# EAGLE schematic UniversalPSU_NoJump (EAGLE 6.6.0)
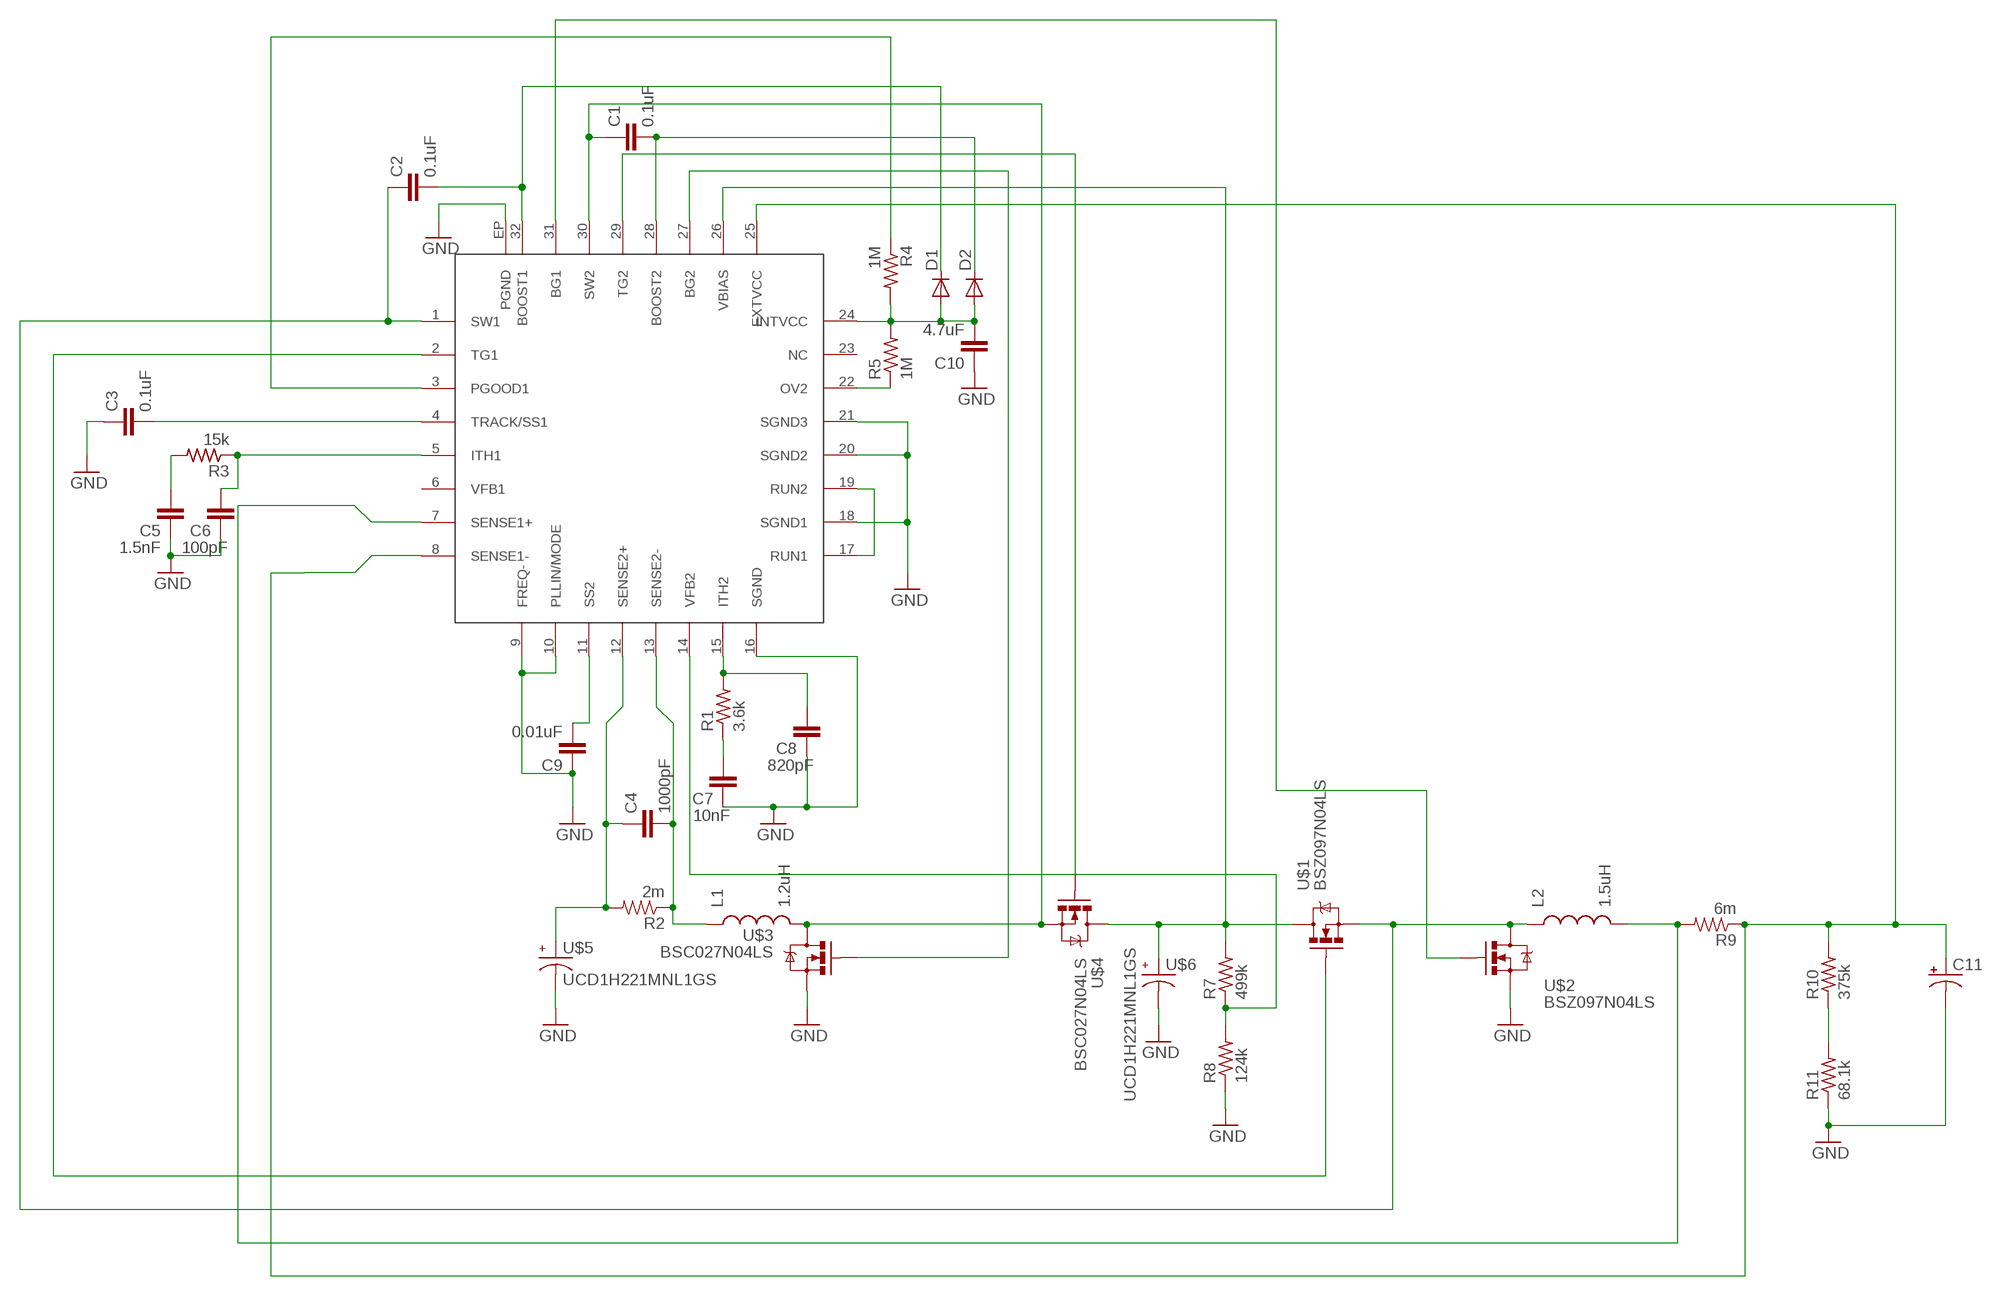
[diagram p0: schematic, sheet 1]

## Parts
C1  0.1uF  RF-C0805  [C0805]
C2  0.1uF  RF-C0805  [C0805]
C3  0.1uF  RF-C0805  [C0805]
C4  1000pF  RF-C0805  [C0805]
C5  1.5nF  RF-C0805  [C0805]
C6  100pF  RF-C0805  [C0805]
C7  10nF  RF-C0805  [C0805]
C8  820pF  RF-C0805  [C0805]
C9  0.01uF  RF-C0805  [C0805]
C10  4.7uF  RF-C0805  [C0805]
C11  CAP_POL7343  [EIA7343]
D1  DIODESOD  [SOD-323]
D2  DIODESOD  [SOD-323]
L1  1.2uH  INDUCTOR  [744325120]
L2  1.5uH  INDUCTOR-1  [744314150]
R1  3.6k  RF-R0805  [RF-C0805]
R2  2m  RESISTOR1206  [1206]
R3  15k  RF-R0805  [RF-C0805]
R4  1M  RF-R0805  [RF-C0805]
R5  1M  RF-R0805  [RF-C0805]
R7  499k  RF-R0805  [RF-C0805]
R8  124k  RF-R0805  [RF-C0805]
R9  6m  RESISTOR1206  [1206]
R10  375k  RF-R0805  [RF-C0805]
R11  68.1k  RF-R0805  [RF-C0805]
U1  LTC7812  [QFN-32_UH]
U$1  BSZ097N04LS  [PG-TSDSON-8]
U$2  BSZ097N04LS  [PG-TSDSON-8]
U$3  BSC027N04LS  [PG-TSDSON-8]
U$4  BSC027N04LS  [PG-TSDSON-8]
U$5  UCD1H221MNL1GS  [10X10CAP]
U$6  UCD1H221MNL1GS  [10X10CAP]

## Nets
GND: C3.1 C5.1 C6.1 C7.1 C8.1 C9.1 C10.1 C11.C(-) R8.1 R11.1 U1.9(FREQ-) U1.10(PLLIN/MODE) U1.16(SGND) U1.18(SGND1) U1.20(SGND2) U1.21(SGND3) U1.EP(PGND) U$2.P$1(S) U$2.P$2(S) U$2.P$3(S) U$3.P$1(S) U$3.P$2(S) U$3.P$3(S) U$5.P$1 U$6.P$1
N$1: C3.2 U1.4(TRACK/SS1)
N$2: C2.2 D1.1(C) U1.32(BOOST1)
N$3: C2.1 L2.P$1 U1.1(SW1) U$1.P$1(S) U$1.P$2(S) U$1.P$3(S) U$2.P$5(D)
N$4: C1.2 D2.1(C) U1.28(BOOST2)
N$5: C1.1 L1.P$2 U1.30(SW2) U$3.P$5(D) U$4.P$1(S) U$4.P$2(S) U$4.P$3(S)
N$6: C8.2 R1.2 U1.15(ITH2)
N$7: C4.2 L1.P$1 R2.1 U1.13(SENSE2-)
N$8: C4.1 R2.2 U1.12(SENSE2+) U$5.P$2
N$9: C6.2 R3.1 U1.5(ITH1)
N$10: C5.2 R3.2
N$11: C7.2 R1.1
N$12: R5.1 U1.22(OV2)
N$13: C9.2 U1.11(SS2)
N$14: R4.1 U1.3(PGOOD1)
N$15: L2.P$2 R9.2 U1.7(SENSE1+)
N$16: C11.A(+) R9.1 R10.2 U1.8(SENSE1-) U1.25(EXTVCC)
N$17: C10.2 D1.2(A) D2.2(A) R4.2 R5.2 U1.24(INTVCC)
N$18: U1.27(BG2) U$3.P$4(G)
N$19: U1.29(TG2) U$4.P$4(G)
N$20: U1.17(RUN1) U1.19(RUN2)
N$21: R7.2 U1.26(VBIAS) U$1.P$5(D) U$4.P$5(D) U$6.P$2
N$22: R7.1 R8.2 U1.14(VFB2)
N$23: U1.2(TG1) U$1.P$4(G)
N$25: U1.31(BG1) U$2.P$4(G)
N$28: R10.1 R11.2
Unconnected: U1.6(VFB1) U1.23(NC)

## Library data of the parts
C1-C10 = GW-devices:RF-C: RF capacitor pads for FSL reference design
C11 = SparkFun:CAP_POL: Capacitor Polarized These are standard SMD and PTH capacitors. Normally 10uF, 47uF, and 100uF in electrolytic and tantalum varieties. Always verify the external diameter of the through hole cap, it varies with capacity, voltage, and manufacturer. The EIA devices should be standard.
D1 D2 = SparkFun:DIODE: Diode These are standard reverse protection diodes and small signal diodes. SMA package can handle up to about 1A. SOD-323 can handle about 200mA. What the SOD-323 package when ordering, there are some mfgs out there that are 5-pin packages.; MFGN: Central Semi; MFGP: CMDSH-4E
L1 L2 = PSU:INDUCTOR: Inductors Basic Inductor/Choke - 0603 and 1206. Footprints are not proven and vary greatly between part numbers.
R1 R3-R5 R7 R8 R10 R11 = GW-devices:RF-R: RF resistor pads for FSL reference design
R2 R9 = SparkFun:RESISTOR: Resistor Basic schematic elements and footprints for 0603, 1206, and PTH resistors.
U1 = PSU:LTC7812
U$1 U$2 = PSU:BSZ097N04LS
U$3 U$4 = PSU:BSC027N04LS
U$5 U$6 = PSU:UCD1H221MNL1GS